# Altium schematic sheet [17] POWER-FILTER_LDO.SchDoc: Power LDO
size 393 x 281 mm; SheetNumber: 17; SheetTotal: 21; PageSetup: Record=PageOptions|CenterHorizontal=True|CenterVertical=True|PrintScale=0.94|XCorrection=0.00|YCorrection=0.00|PrintKind=0|BorderSize=5000000|LeftOffset=0|BottomOffset=0|Orientation=2|PaperLength=1000|PaperWidth=1000|Scale=100|PaperSource=15|PrintQuality=600|MediaType=1|DitherType=10|PrintScaleMode=1|PaperKind=A4; Adr1: August Barks gata 6B; Adr2: SE-421 32 Västra Frölunda; Adr3: Sweden; Webpage: www.omnisys.se
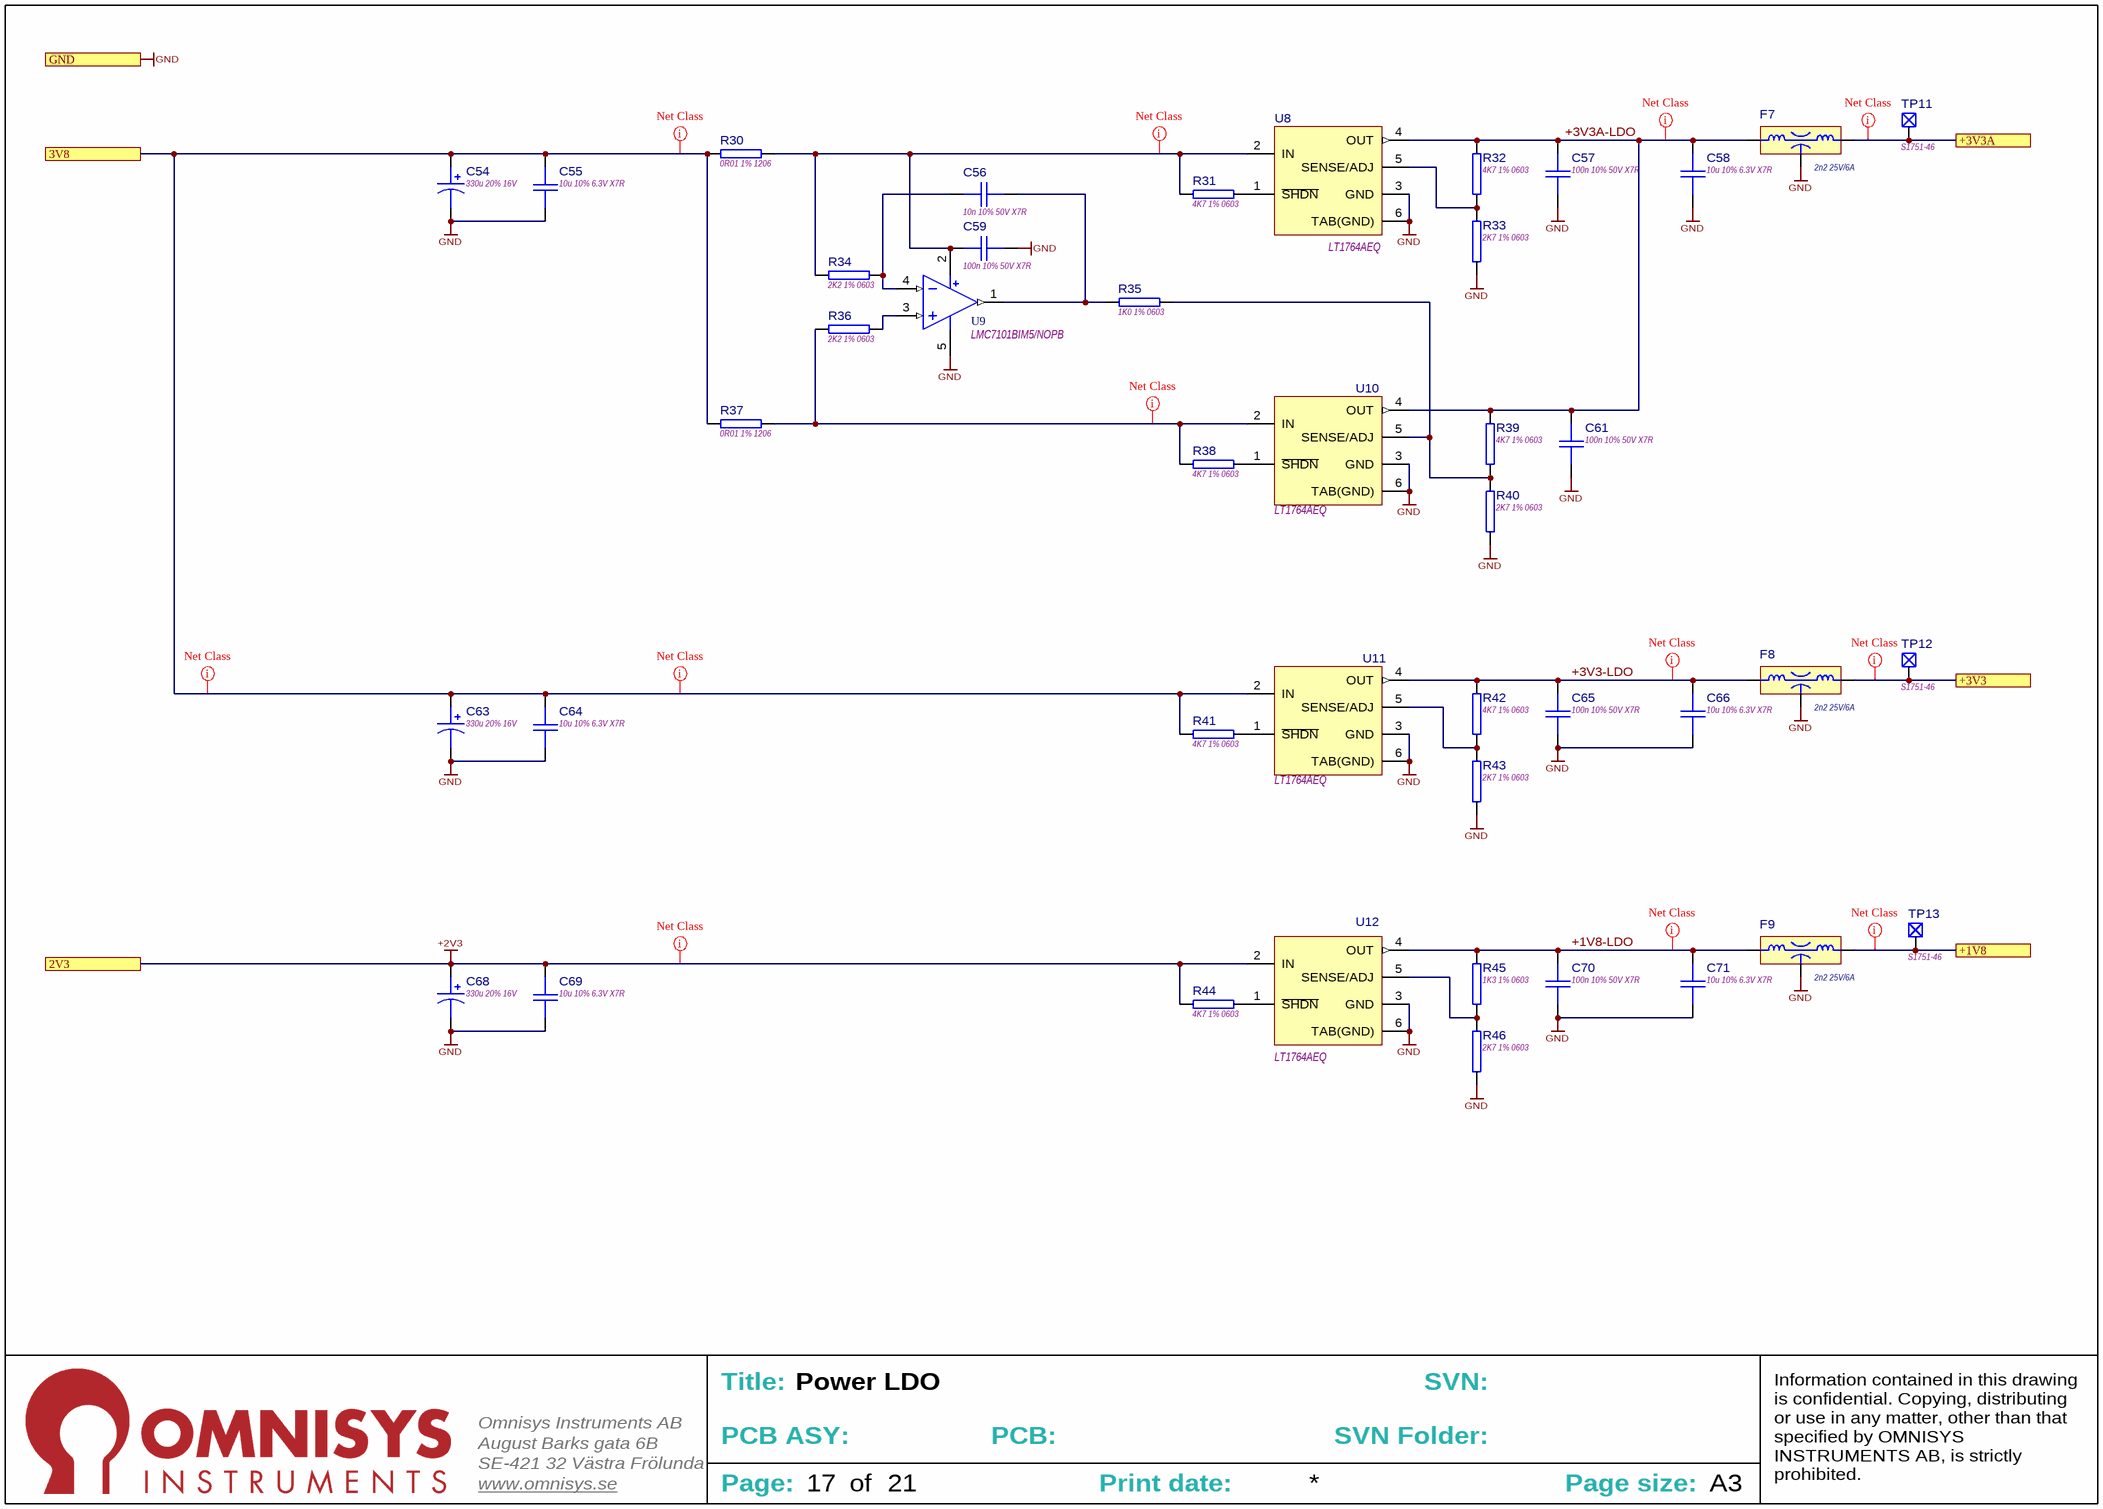
[diagram p0: [17] POWER-FILTER_LDO.SchDoc]

## Parts
C54  330u 20% 16V  [CAPMP7343X43N]
C55  10u 10% 6.3V X7R  [CAPC2012X145N]
C56  10n 10% 50V X7R  [CAPC1608X90N]
C57  100n 10% 50V X7R  [CAPC1608X90N]
C58  10u 10% 6.3V X7R  [CAPC2012X145N]
C59  100n 10% 50V X7R  [CAPC1608X90N]
C61  100n 10% 50V X7R  [CAPC1608X90N]
C63  330u 20% 16V  [CAPMP7343X43N]
C64  10u 10% 6.3V X7R  [CAPC2012X145N]
C65  100n 10% 50V X7R  [CAPC1608X90N]
C66  10u 10% 6.3V X7R  [CAPC2012X145N]
C68  330u 20% 16V  [CAPMP7343X43N]
C69  10u 10% 6.3V X7R  [CAPC2012X145N]
C70  100n 10% 50V X7R  [CAPC1608X90N]
C71  10u 10% 6.3V X7R  [CAPC2012X145N]
F7  2n2 25V/6A  [FIL_NFE31P]
F8  2n2 25V/6A  [FIL_NFE31P]
F9  2n2 25V/6A  [FIL_NFE31P]
R30  0R01 1% 1206  [RESC3216N]
R31  4K7 1% 0603  [RESC1608N]
R32  4K7 1% 0603  [RESC1608N]
R33  2K7 1% 0603  [RESC1608N]
R34  2K2 1% 0603  [RESC1608N]
R35  1K0 1% 0603  [RESC1608N]
R36  2K2 1% 0603  [RESC1608N]
R37  0R01 1% 1206  [RESC3216N]
R38  4K7 1% 0603  [RESC1608N]
R39  4K7 1% 0603  [RESC1608N]
R40  2K7 1% 0603  [RESC1608N]
R41  4K7 1% 0603  [RESC1608N]
R42  4K7 1% 0603  [RESC1608N]
R43  2K7 1% 0603  [RESC1608N]
R44  4K7 1% 0603  [RESC1608N]
R45  1K3 1% 0603  [RESC1608N]
R46  2K7 1% 0603  [RESC1608N]
TP11  S1751-46  [S1751-46]
TP12  S1751-46  [S1751-46]
TP13  S1751-46  [S1751-46]
U8  LT1764AEQ  [TO170P1394X457-6N]
U9  LMC7101BIM5/NOPB  [SOT95P280X100-5N]
U10  LT1764AEQ  [TO170P1394X457-6N]
U11  LT1764AEQ  [TO170P1394X457-6N]
U12  LT1764AEQ  [TO170P1394X457-6N]

## Ports
2V3, 3V8, +1V8, +3V3, +3V3A, GND

## Nets
+2V3: C68.1 C69.1 R44.1 U12.2(IN) ; port 2V3
GND: C54.2 C55.2 C57.2 C58.2 C59.2 C61.2 C63.2 C64.2 C65.1 C66.2 C68.2 C69.2 C70.1 C71.2 F7.3(Gnd) F8.3(Gnd) F9.3(Gnd) R33.2 R40.2 R43.2 R46.2 U8.3(GND) U8.6(TAB(GND)) U9.5(V-) U10.3(GND) U10.6(TAB(GND)) U11.3(GND) U11.6(TAB(GND)) U12.3(GND) U12.6(TAB(GND)) ; port GND
3V8: C54.1 C55.1 C63.1 C64.1 R30.1 R37.1 R41.1 U11.2(IN) ; port 3V8
+1V8: F9.2(Out) TP13.1 ; port +1V8
+1V8-LDO: C70.2 C71.1 F9.1(In) R45.1 U12.4(OUT)
+3V3: F8.2(Out) TP12.1 ; port +3V3
+3V3-LDO: C65.2 C66.1 F8.1(In) R42.1 U11.4(OUT)
+3V3A: F7.2(Out) TP11.1 ; port +3V3A
+3V3A-LDO: C57.1 C58.1 C61.1 F7.1(In) R32.1 R39.1 U8.4(OUT) U10.4(OUT)
NetC56_1: C56.1 R34.2 U9.4(IN-)
NetC56_2: C56.2 R35.1 U9.1(OUT)
NetC59_1: C59.1 R30.2 R31.1 R34.1 U8.2(IN) U9.2(V+)
NetR31_2: R31.2 U8.1(~{SHDN})
NetR32_2: R32.2 R33.1 U8.5(SENSE/ADJ)
NetR35_2: R35.2 R39.2 R40.1 U10.5(SENSE/ADJ)
NetR36_1: R36.1 R37.2 R38.1 U10.2(IN)
NetR36_2: R36.2 U9.3(IN+)
NetR38_2: R38.2 U10.1(~{SHDN})
NetR41_2: R41.2 U11.1(~{SHDN})
NetR42_2: R42.2 R43.1 U11.5(SENSE/ADJ)
NetR44_2: R44.2 U12.1(~{SHDN})
NetR45_2: R45.2 R46.1 U12.5(SENSE/ADJ)

## Layout directives
net class Power: 3V8, +1V8, +1V8-LDO, +2V3, +3V3, +3V3-LDO, +3V3A, +3V3A-LDO, NetC59_1, NetR36_1

## Notes on the sheet
- Title:
- SVN:
- August Barks gata 6B
- SE-421 32 Västra Frölunda
- Omnisys Instruments AB
- PCB ASY:
- PCB:
- SVN Folder:
- www.omnisys.se
- Page:
- of
- Print date:
- Page size:
- A3
- Information contained in this drawing is confidential. Copying, distributing or use in any matter, other than that specified by OMNISYS INSTRUMENTS AB, is strictly prohibited.

## Library data of the parts
C54 C63 C68 = CMP-0300-000208-8: Standard tantalum capacitor, 7343/Case E; DCL: 52.8A; DF: 30%; ESR: 0.4; Capacitance: 330µF; Tolerance: 20%; Rated Voltage: 16V; Case/Package: 7343
C55 C58 C64 C66 C69 C71 = CMP-0300-002090-7: Ceramic Chip Capacitor, 0805/2012; Capacitance: 10µF; Package: 2012/0805; Temperature Charateristics: X7R; Tolerance: 10%; Rated Voltage: 6.3V; Thickness: 1.4mm
C56 = CMP-0300-002475-6: Ceramic Chip Capacitor, 0603/1608; Temperature Charateristics: C0G; Tolerance: 5%; Capacitance: 10nF; Package: 1608/0603; Rated Voltage: 50V; Thickness: 900µm; Weight: 9mg
C57 C59 C61 C65 C70 = CMP-0300-002665-6: Ceramic Chip Capacitor, 0603/1608; Capacitance: 100nF; Package: 1608/0603; Temperature Charateristics: X7R; Tolerance: 10%; Rated Voltage: 50V; Thickness: 900µm; Weight: 9mg
F7-F9 = CMP-0600-000138-4: 2n2 +50%-50%  25V/6A NFE31PT222Z1E9 LC Combined Filter Feed through Type; Max Current: 6A; Max Voltage: 25V; Tolerance: +50%-50%; PartNumber: NFE31PT222Z1E9
R30 R37 = CMP-1800-002821-3: Thick film Chip Resistor, 1206/3216; Value: 10m; Temp. Coefficent: 0.01%; Maximum working voltage: 200V; Power: 250mW; Tolerance: 1%; Case/Package: 1206/3216; Composition: Thick film
R31 R32 R38 R39 R41 R42 R44 = CMP-1800-002037-5: Thick film Chip Resistor, 0603/1608; Value: 4.7k; Power: 100mW; Maximum working voltage: 75V; Temp. Coefficent: 0.01%; Tolerance: 1%; Case/Package: 0603/1608; Composition: Thick film
R33 R40 R43 R46 = CMP-1800-002031-5: Thick film Chip Resistor, 0603/1608; Value: 2.7k; Power: 100mW; Maximum working voltage: 75V; Temp. Coefficent: 0.01%; Tolerance: 1%; Case/Package: 0603/1608; Composition: Thick film
R34 R36 = CMP-1800-002029-5: Thick film Chip Resistor, 0603/1608; Value: 2.2k; Power: 100mW; Maximum working voltage: 75V; Temp. Coefficent: 0.01%; Tolerance: 1%; Case/Package: 0603/1608; Composition: Thick film
R35 = CMP-1800-002021-5: Thick film Chip Resistor, 0603/1608; Maximum working voltage: 75V; Temp. Coefficent: 0.01%; Value: 1k; Power: 100mW; Tolerance: 1%; Case/Package: 0603/1608; Composition: Thick film
R45 = CMP-1800-002024-5: Thick film Chip Resistor, 0603/1608; Value: 1.3k; Power: 100mW; Maximum working voltage: 75V; Temp. Coefficent: 0.01%; Tolerance: 1%; Case/Package: 0603/1608; Composition: Thick film
TP11-TP13 = CMP-3600-000004-2: SMD Test point clip; PartNumber: S1751-46
U8 U10-U12 = CMP-2100-000275-3: 3A, Fast Transient Respons, Low noise LOD regulator; Output Voltage: 1.21V to 20V; Input Voltage max: 20V; Vdo: 340mV; Case: D2-PAK-5; Output current: 3A
U9 = CMP-2100-000592-1: IC, OP AMP, SINGLE, 1MHZ, SMD; Voltage Gain: 110.63dB; Number of Channels: 1; Input Offset Voltage (Vos): 110uV; Input Bias Current: 1pA; Max Supply Voltage: 15.5V; Power Supply Rejection Ratio (PSRR): 65dB; Max Supply Current: 850uA; Operating Supply Current: 800uA; Output Current: 50mA; Min Supply Voltage: 2.7V; Common Mode Rejection Ratio: 60dB; Slew Rate: 1.1V/µs; Gain Bandwidth Product: 1.1MHz; Unity Gain Bandwidth Product: 1MHz; Width: 1.6mm; Number of Pins: 5; Bandwidth: 1MHz; Package Quantity: 1000; Case/Package: SOT-23; Number of Circuits: 1; Number of Amplifiers: 1; Min Operating Temperature: -40°C; Number of Elements: 1; Height: 1.02mm; Output Current per Channel: 50mA; Max Operating Temperature: 85°C; Mount: Surface Mount; Lead Free: Lead Free; Length: 2.92mm; Radiation Hardening: No; REACH SVHC: No SVHC; Packaging: Tape and Reel; Nominal Supply Current: 800uA